# EAGLE design +49V (EAGLE 6.5.0)

## Sheet 1 of 2
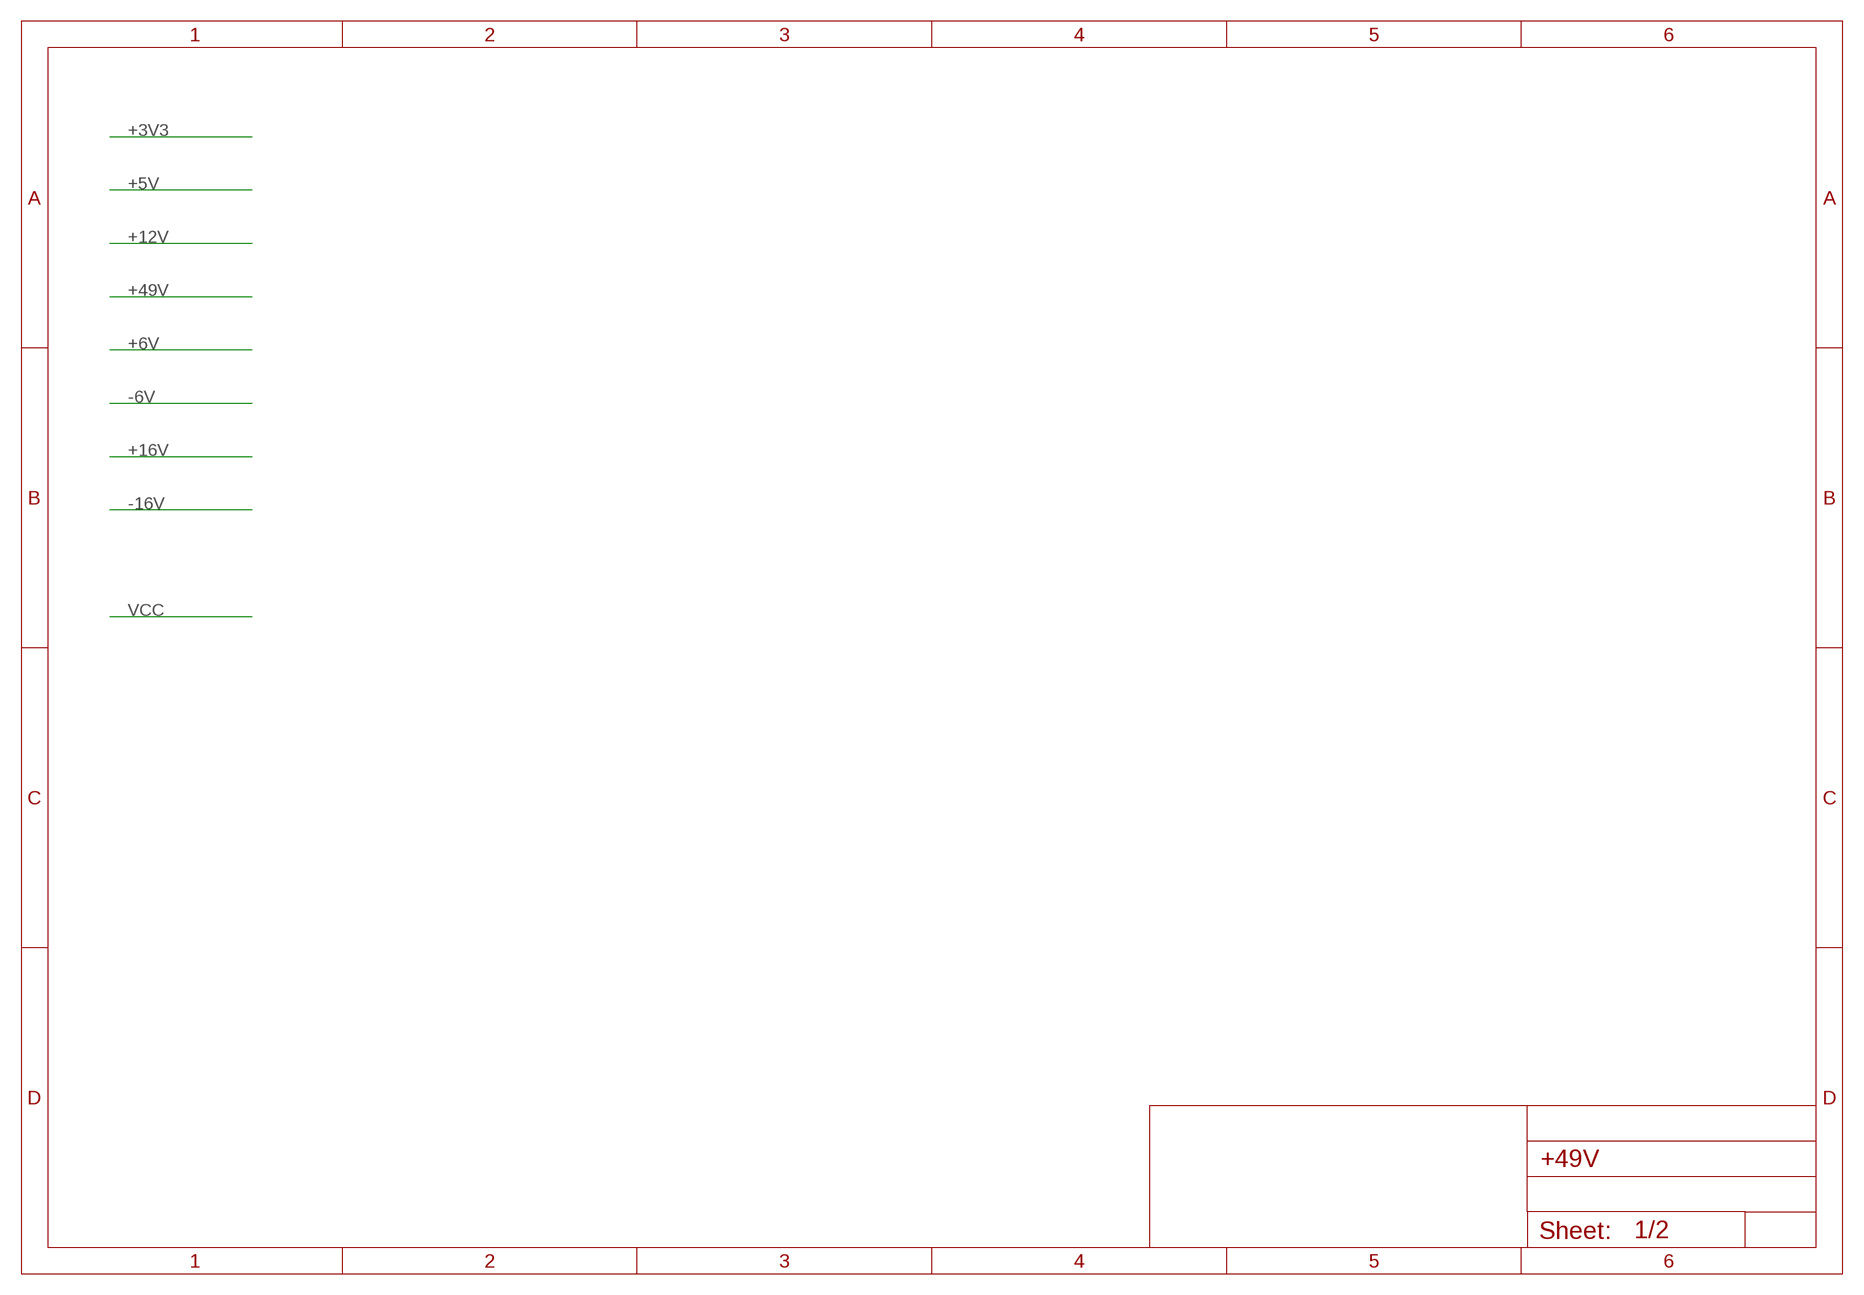
[diagram p0: schematic, sheet 1]
FRAME1 (FRAME): EXCLUDE_FROM_BOM: YES

## Sheet 2 of 2
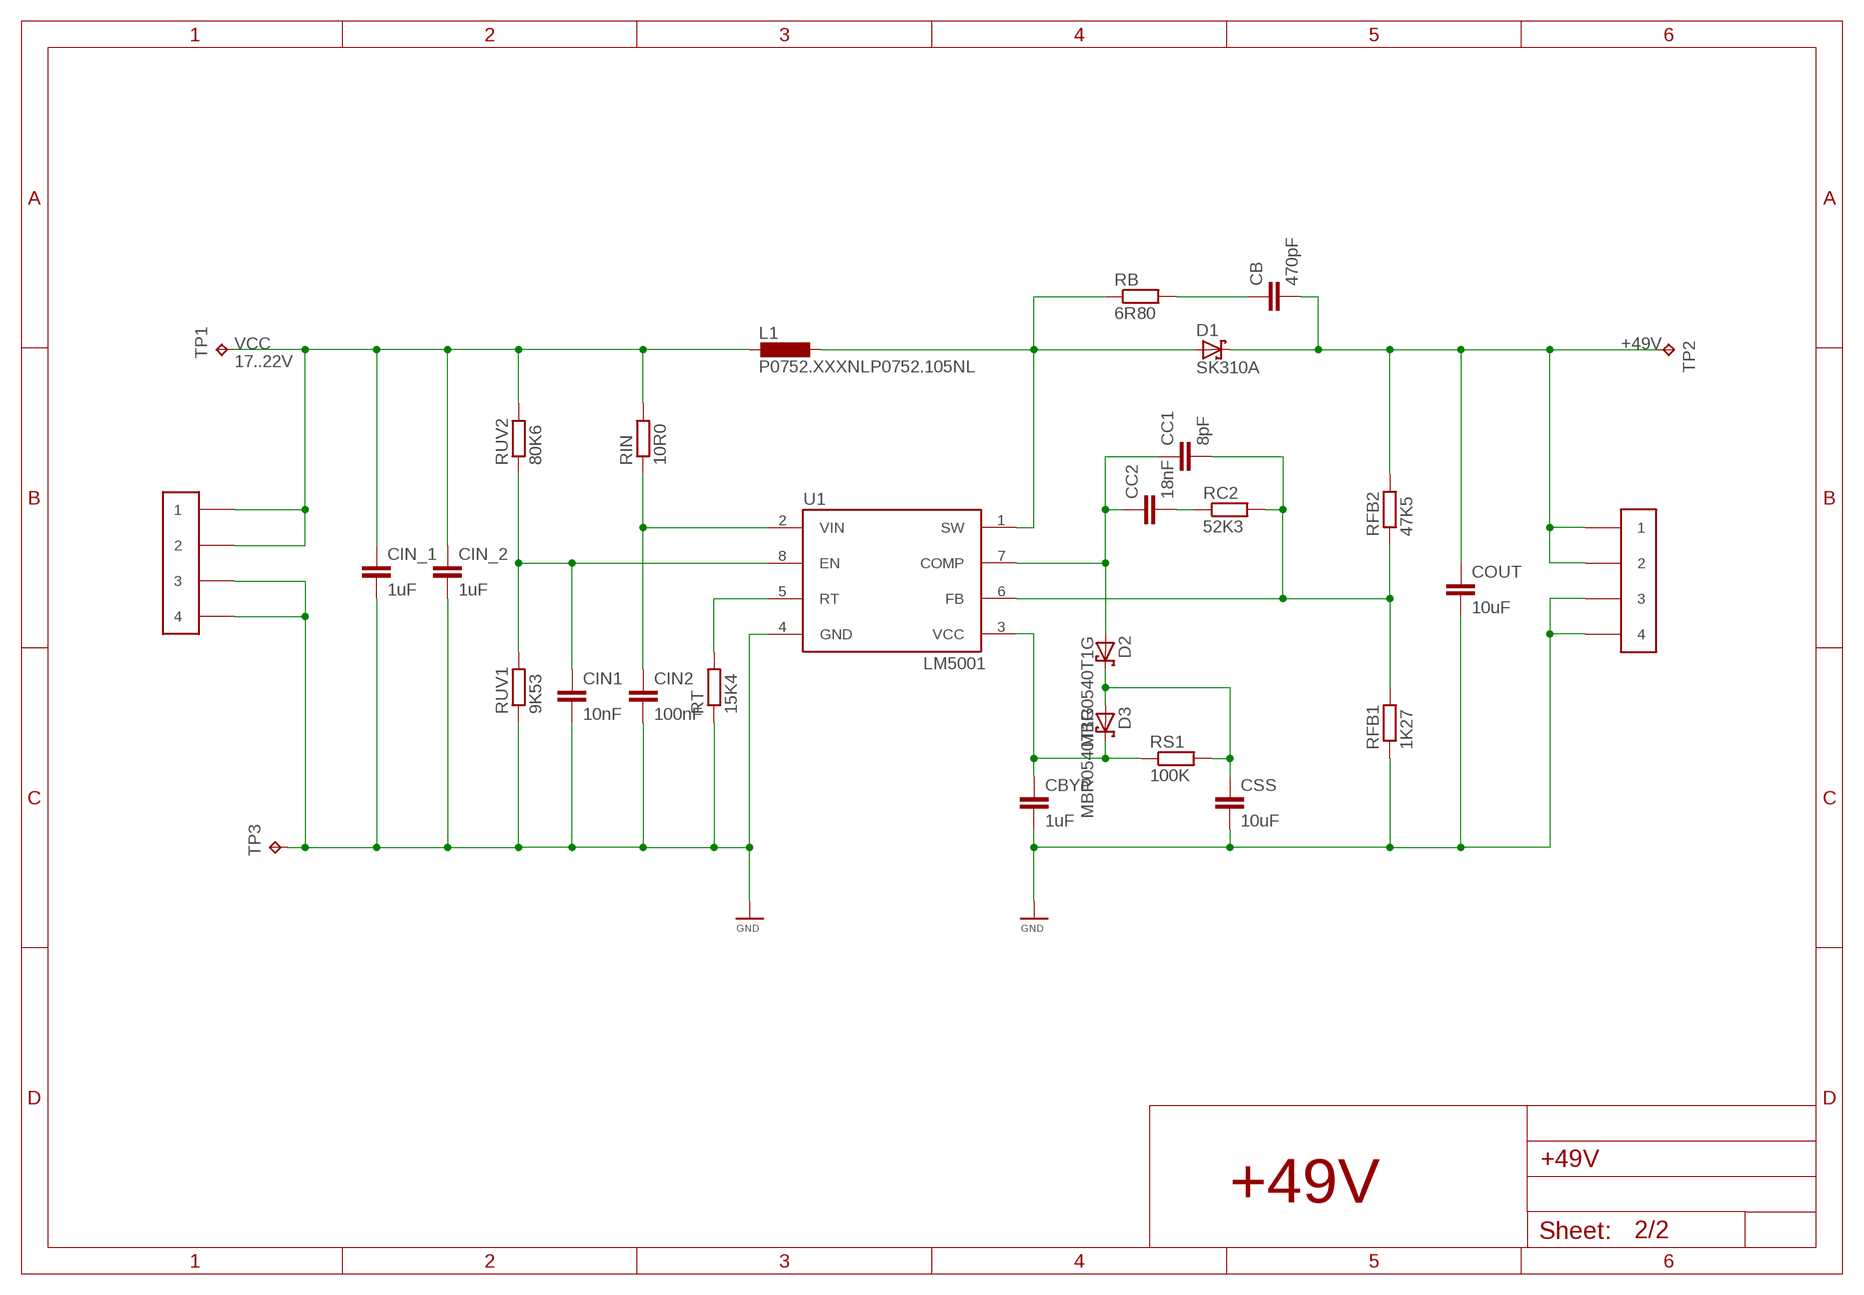
[diagram p1: schematic, sheet 2]
FRAME2 (FRAME): EXCLUDE_FROM_BOM: YES

### Parts
CB  470pF  C0603  [C0603]
CBYP  1uF  C0603  [C0603]
CC1  8pF  C0805  [C0805]
CC2  18nF  C0805  [C0805]
CIN1  10nF  C0805  [C0805]
CIN2  100nF  C0805  [C0805]
CIN_1  1uF  C1206  [C1206]
CIN_2  1uF  C1206  [C1206]
COUT  10uF  C2220  [C2220K]
CSS  10uF  C0805  [C0805]
D1  SK310A  [DO214AC]
D2  MBR0540T1G  [SOD123]
D3  MBR0540T1G  [SOD123]
L1  P0752.XXXNLP0752.105NL  [P0752.XXXNL]
RB  6R80  R0805  [R0805]
RC2  52K3  R0603  [R0603]
RFB1  1K27  R0603  [R0603]
RFB2  47K5  R0603  [R0603]
RIN  10R0  R0603  [R0603]
RS1  100K  R0603  [R0603]
RT  15K4  R0603  [R0603]
RUV1  9K53  R0603  [R0603]
RUV2  80K6  R0603  [R0603]
TP1  TP  [TESTPAD]
TP2  TP  [TESTPAD]
TP3  TP  [TESTPAD]
U1  LM5001MAX  [SOIC8]
X1  PINCON-1X4  [PINCON-1X4]
X2  PINCON-1X4  [PINCON-1X4]

### Nets
+49V: CB.2 COUT.1 D1.C RFB2.2 TP2.P$1(TP) X2.P$1 X2.P$2 ; also sheet 1
GND: CBYP.2 CIN1.2 CIN2.2 CIN_1.2 CIN_2.2 COUT.2 CSS.2 RFB1.1 RT.1 RUV1.1 TP3.P$1(TP) U1.4(GND) X1.P$3 X1.P$4 X2.P$3 X2.P$4
N$1: CBYP.1 D3.C RS1.1 U1.3(VCC)
N$2: RT.2 U1.5(RT)
N$3: CIN2.1 RIN.1 U1.2(VIN)
N$4: CIN1.1 RUV1.2 RUV2.1 U1.8(EN)
N$6: D1.A L1.P$1 RB.1 U1.1(SW)
N$7: CB.1 RB.2
N$9: CC1.1 CC2.1 D2.A U1.7(COMP)
N$10: CC2.2 RC2.1
N$11: CC1.2 RC2.2 RFB1.2 RFB2.1 U1.6(FB)
N$12: CSS.1 D2.C D3.A RS1.2
VCC: CIN_1.1 CIN_2.1 L1.P$2 RIN.2 RUV2.2 TP1.P$1(TP) X1.P$1 X1.P$2 ; also sheet 1

### Notes on the sheet
- 17..22V
- +49V

## Library data of the parts
CB CC1 CC2 = plr_rcl:C
CBYP = plr_rcl:C; MANUFACTURER: Murata; MPN: GRM155R61A105KE15D; OC_DIGIKEY: 490-3890-1-ND; OC_FARNELL: 1735523; OC_MOUSER: 81-GRM155R61A105KE15
CIN1 = plr_rcl:C; MANUFACTURER: Murata; MPN: GRM216R71H103KA01D; OC_DIGIKEY: 490-1664-1-ND; OC_FARNELL: 1828948; OC_MOUSER: 81-GRM40X103K50D
CIN2 = plr_rcl:C; MANUFACTURER: Kemet; MPN: C0805C104K5RACTU; OC_DIGIKEY: 399-1170-1-ND; OC_FARNELL: 2392344; OC_MOUSER: 80-C0805C104K5R
CIN_1 CIN_2 = plr_rcl:C; MANUFACTURER: TDK; MPN: C3216X7R1H105K160AB; OC_DIGIKEY: 445-1423-1-ND; OC_FARNELL: 1907358; OC_MOUSER: 810-C3216X7R1H105K
COUT = plr_rcl:C; MANUFACTURER: TDK; MPN: C5750X7S2A106M; OC_DIGIKEY: 445-5212-1-ND; OC_FARNELL: 2112740; OC_MOUSER: 810-C5750X7S2A106M
CSS = plr_rcl:C; MANUFACTURER: Tayo Yuden; MPN: LMK212BJ106KG-T; OC_DIGIKEY: 587-1300-1-ND; OC_MOUSER: 963-LMK212BJ106KG-T
D1 = plr_diodes:SK310A; MANUFACTURER: MCC; MPN: SK310A-TP; OC_DIGIKEY: SK310A-TPCT-ND; OC_MOUSER: 833-SK310A-TP
D2 D3 = plr_diodes:MBR0540T1G; MANUFACTURER: ON SEMI; MPN: MBR0540T1G; OC_DIGIKEY: MBR0540T1GOSCT-ND; OC_FARNELL: 9556923; OC_MOUSER: 863-MBR0540T1G
L1 = plr_rcl:P0752.XXXNL; MANUFACTURER: PULSE; MPN: P0752.104NLT; OC_DIGIKEY: 553-1067-1-ND; OC_FARNELL: 2215852; OC_MOUSER: 673-P0752.104NLT
RB = plr_rcl:R; MANUFACTURER: Yageo; MPN: RC0805FR-076R8L; OC_DIGIKEY: 311-6.80CRCT-ND; OC_FARNELL: 9237224
RC2 RFB1 RFB2 RIN RS1 RT RUV1 RUV2 = plr_rcl:R
TP1-TP3 = plr_common:TP; EXCLUDE_FROM_BOM: YES
U1 = plr_vreg:LM5001; MANUFACTURER: TI; MPN: LM5001MA/NOPB; OC_DIGIKEY: LM5001MA/NOPB-ND; OC_FARNELL: LM5001MA/NOPB; OC_MOUSER: 926-LM5001MA/NOPB
X1 X2 = plc_con:PINCON-1X4

## Board
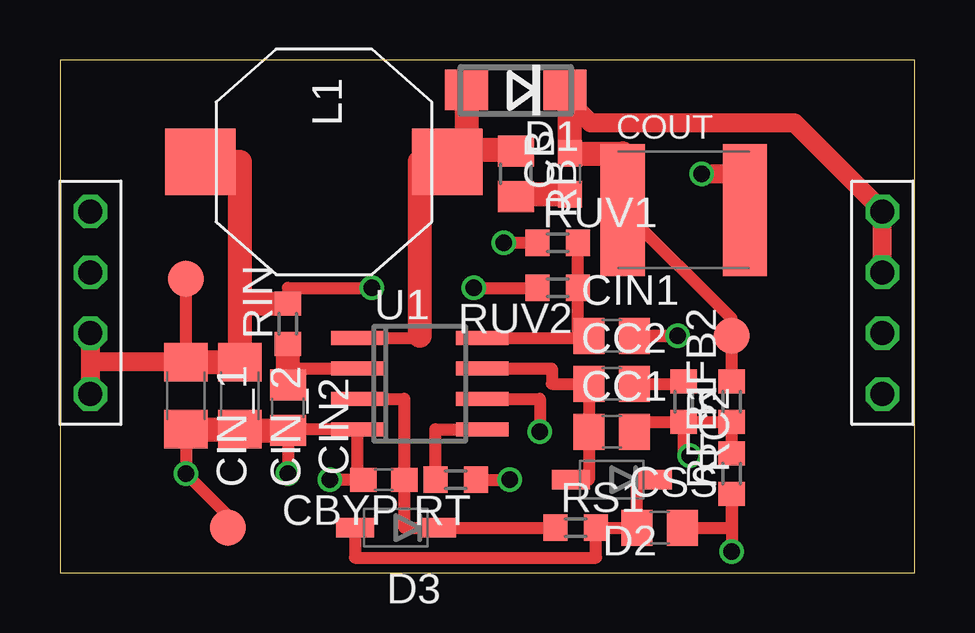
[diagram p2: board, top side]
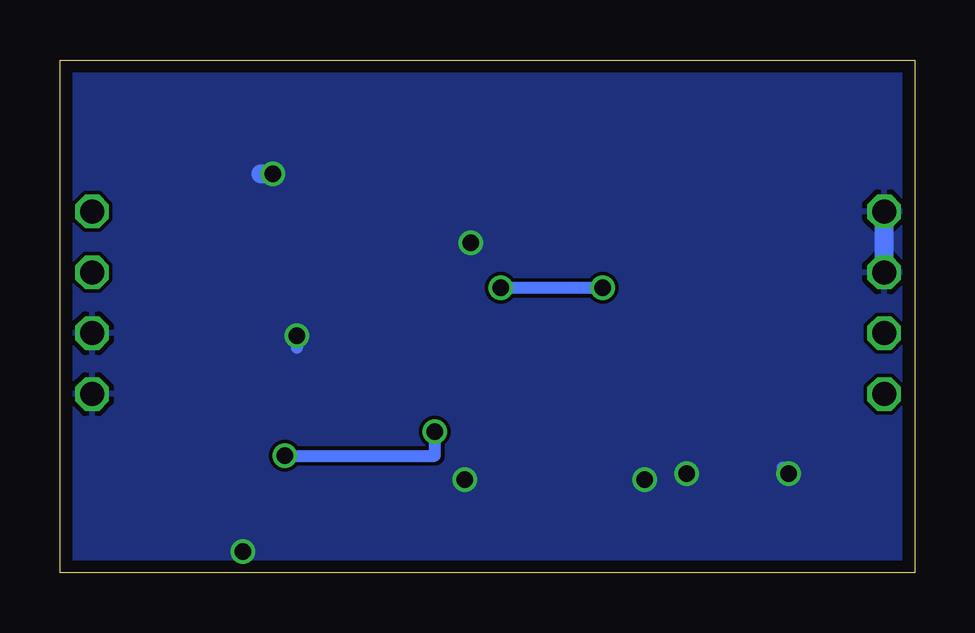
[diagram p3: board, bottom side, seen from below]

Size 35.62 x 21.38 mm. Coordinates in mm from the lower left corner, seen from the top.
Outline: 0,0 35.62,0 35.62,21.38 0,21.38 0,0
Copper layers (1*16): Top 0.035mm / dielectric 1.5mm / Bottom 0.035mm
Design rules "multi-cb_035um-cu_en *": minimum track width 6mil, minimum drill 12mil, track to track 6mil, track to pad 6mil, pad to pad 6mil, via to via 6mil, smd to smd 6mil, copper to edge 20mil, drill to drill 8mil, minimum pad ring 8mil, minimum via ring 6mil, stop-mask expansion 3mil, vias tented up to drill 0mil, thermal gap 8mil

### Footprints (pad centres in the part's own frame; a part is rotated, then mirrored left to right if it is on the bottom)
C0603 = smd 1.1 x 1: 1 -0.85,0; 2 0.85,0
C0805 = smd 1.3 x 1.5: 1 -0.95,0; 2 0.95,0
C1206 = smd 1.6 x 1.8: 1 -1.4,0; 2 1.4,0
C2220K = smd 1.85 x 5.5: 1 -2.55,0; 2 2.55,0
DO214AC = smd 1.8 x 1.7: A 2.05,0; C -2.05,0
SOD123 = smd 1.6 x 0.8: A 1.7,0; C -1.7,0
P0752.XXXNL = smd 2.79 x 2.92: P$1 0,5.145; P$2 0,-5.145
R0805 = smd 1.3 x 1.5: 1 -0.95,0; 2 0.95,0
R0603 = smd 1 x 1.1: 1 -0.85,0; 2 0.85,0
TESTPAD = smd 1.5 x 1.5: P$1 0,0
SOIC8 = smd 0.6 x 2.2: 1 -1.905,-2.6; 2 -0.635,-2.6; 3 0.635,-2.6; 4 1.905,-2.6; 5 1.905,2.6; 6 0.635,2.6; 7 -0.635,2.6; 8 -1.905,2.6
PINCON-1X4 = drill 1 octagon: P$1 -3.81,0; P$2 -1.27,0; P$3 1.27,0; P$4 3.81,0

### Placement (x,y rotation side)
CB  21.25,16.62 90 top
CBYP  13.5,3.88 180 top
CC1  23,5.88 0 top
CC2  23,7.88 0 top
CIN1  23,9.88 0 top
CIN2  9.5,6.88 270 top
CIN_1  5.25,7.38 270 top
CIN_2  7.5,7.38 270 top
COUT  26,15.12 0 top
CSS  25,1.88 0 top
D1  19,20.12 180 top
D2  23,3.88 180 top
D3  14,1.88 180 top
L1  11,17.12 270 top
RB  19,16.62 270 top
RC2  26,7.12 270 top
RFB1  28,4.12 90 top
RFB2  28,7.12 90 top
RIN  9.5,10.38 90 top
RS1  21.5,1.88 0 top
RT  16.5,3.88 180 top
RUV1  20.75,13.75 0 top
RUV2  20.75,11.88 180 top
TP1  5.25,12.25 0 top
TP2  28,9.88 0 top
TP3  7,1.88 0 top
U1  15,7.88 270 top
X1  1.27,11.25 90 top
X2  34.29,11.25 270 top

### Tracks (layer width: path | path; a pad name or v marks a point on that pad's centre or on a via)
+49V
  Top 0.5: RFB2.2 TP2.P$1 28,10.57 COUT.1
  Top 0.8: X2.P$1 X2.P$2 34.29,15.09 30.62,18.75 22.12,18.75 21.25,19.62
  Top 1: 20.75,20.12 D1.C 21.25,19.93 21.25,19.62 CB.2 23.45,17.48 COUT.1
GND  (via drill 0.7)
  Top 0.5: CSS.2 28,1.88 RFB1.1 v28,0.88 | v25.75,9.88 CIN1.2 25.35,9.88 | CIN_1.2 v5.25,4.12 7,2.38 TP3.P$1 | v9.5,4.12 CIN2.2 9.5,5.97 U1.4 12.4,3.88 CBYP.2 v11.25,3.88 | RT.1 v18.75,3.88 | RUV1.1 v18.5,13.75
  Top 0.8: COUT.2 28.55,16.62 v26.75,16.62
  Top 1: CIN_1.2 CIN_2.2 7.5,5.92 CIN2.2
  Bottom 0.5: v25.75,9.88 25.75,9.38 | v5.25,4.12 5.5,4.38 | v9.5,4.12 9.5,4.38 | v11.25,3.88 11.5,3.88 | v28,0.88 28,1.12 | v18.75,3.88 18.5,3.88 | v18.5,13.75 18.75,13.75
  Bottom 0.8: v26.75,16.62 27.25,16.62 | X1.P$3 1.27,15.11 1.25,15.12
  pour Bottom: -1,28 46,28 46,-2 -1,-2
N$1
  Top 0.5: U1.3 14.35,7.24 CBYP.1 14.35,1.88 D3.C RS1.1
N$2
  Top 0.5: RT.2 15.65,5.97 U1.5
N$3
  Top 0.5: CIN2.1 9.5,8.51 U1.2
  Top 1: CIN2.1 RIN.1
N$4
  Top 0.5: U1.8 22.05,9.78 CIN1.1 | CIN1.1 22.35,9.88 | RUV1.2 RUV2.1 21.6,9.88 CIN1.1
N$6
  Top 0.5: U1.1 15,9.78 15,9.88
  Top 1: 15,9.88 15,17.12 L1.P$1 16.14,17.62 16.95,17.62 | RB.1 19,17.62 16.95,17.62 | D1.A 16.95,17.62
N$7
  Top 1: RB.2 19,15.78 CB.1
N$9
  Top 0.5: U1.7 20.5,8.51 20.5,7.88 CC2.1 CC1.1 22.05,3.88 D2.A
N$10
  Top 0.5: CC2.2 26,7.88 RC2.1
N$11  (via drill 0.7)
  Top 0.5: CC1.2 23.95,6.28 RC2.2 | RFB1.2 RFB2.1 RC2.2 | U1.6 20,7.24 v20,5.88 | v26.25,4.88 26,4.88 RC2.2
  Bottom 0.5: v26.25,4.88 20,4.88 v20,5.88
N$12
  Top 0.5: D3.A 12.3,0.62 22.35,0.62 RS1.2 CSS.1 24.05,3.88 D2.C
VCC  (via drill 0.7)
  Top 0.5: v13,11.88 9.5,11.88 RIN.2 | v17.25,11.88 RUV2.2 | CIN_1.1 TP1.P$1
  Top 0.8: CIN_1.1 1.27,8.78 | 1.27,8.78 X1.P$1 | X1.P$2 1.27,8.78
  Top 1: CIN_1.1 CIN_2.1 7.5,11.22 | 7.5,11.22 RIN.2 | 7.5,11.22 7.5,17.12 L1.P$2
  Bottom 0.5: v13,11.88 v17.25,11.88